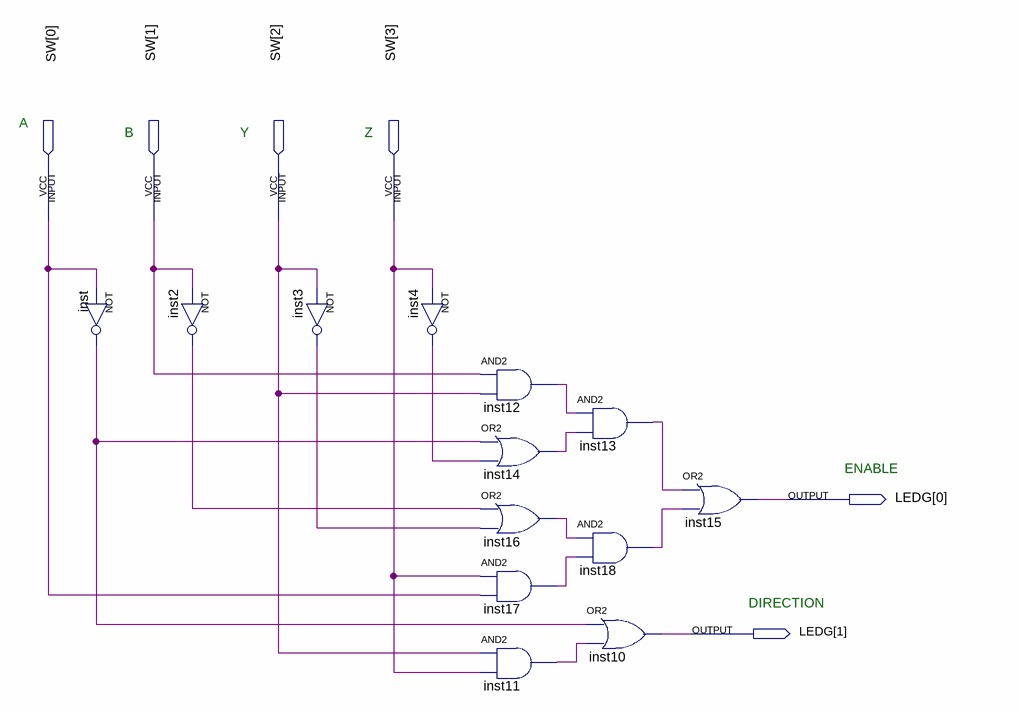
[diagram p0: schematic sheet]
// Quartus schematic BME_393L__pre_lab__3_2.bdf as structural Verilog: 13 symbols, 6 pins
module BME_393L__pre_lab__3_2 (
  input  [3:0] SW,
  output [1:0] LEDG
);

  wire inst2_out, inst3_out, inst4_out, inst11_out, inst12_out, inst13_out, inst14_out, inst16_out,
       inst17_out, inst18_out, inst_out;

  not inst (inst_out, SW[0]);
  not inst2 (inst2_out, SW[1]);
  not inst3 (inst3_out, SW[2]);
  not inst4 (inst4_out, SW[3]);
  and inst12 (inst12_out, SW[1], SW[2]);
  or inst14 (inst14_out, inst_out, inst4_out);
  or inst16 (inst16_out, inst2_out, inst3_out);
  and inst17 (inst17_out, SW[3], SW[0]);
  and inst11 (inst11_out, SW[2], SW[3]);
  and inst13 (inst13_out, inst12_out, inst14_out);
  and inst18 (inst18_out, inst16_out, inst17_out);
  or inst10 (LEDG[1], inst_out, inst11_out);
  or inst15 (LEDG[0], inst13_out, inst18_out);

  // Notes on the sheet:
  //   A
  //   B
  //   Y
  //   Z
  //   ENABLE
  //   DIRECTION
endmodule
